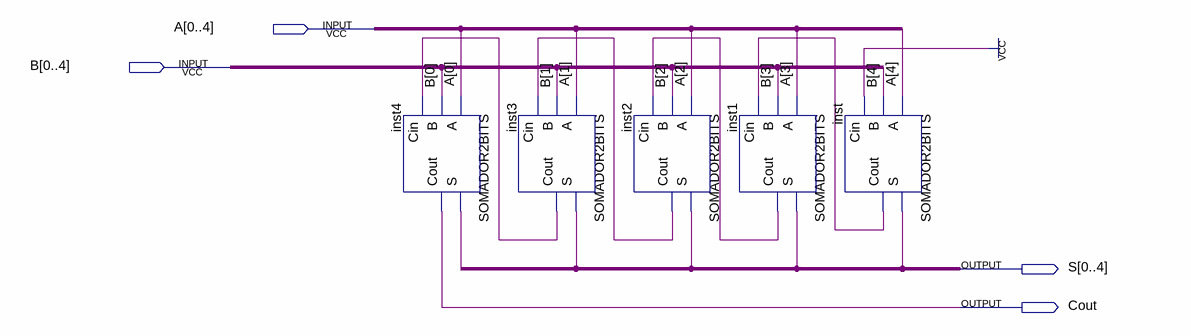
[diagram p0: schematic sheet]
// Quartus schematic COMPLEMENTADOR2.bdf as structural Verilog: 5 symbols, 4 pins
module COMPLEMENTADOR2 (
  input  [0:4] A,
  input  [0:4] B,
  output [0:4] S,
  output Cout
);

  wire inst1_cout, inst1_s, inst2_cout, inst2_s, inst3_cout, inst3_s, inst4_s, inst_cout, inst_s;

  SOMADOR2BITS inst4 (.A(A[0]), .B(B[0]), .Cin(inst3_cout), .S(inst4_s), .Cout(Cout));
  SOMADOR2BITS inst3 (.A(A[1]), .B(B[1]), .Cin(inst2_cout), .S(inst3_s), .Cout(inst3_cout));
  SOMADOR2BITS inst2 (.A(A[2]), .B(B[2]), .Cin(inst1_cout), .S(inst2_s), .Cout(inst2_cout));
  SOMADOR2BITS inst1 (.A(A[3]), .B(B[3]), .Cin(inst_cout), .S(inst1_s), .Cout(inst1_cout));
  SOMADOR2BITS inst (.A(A[4]), .B(B[4]), .Cin(1'b1), .S(inst_s), .Cout(inst_cout));
endmodule
